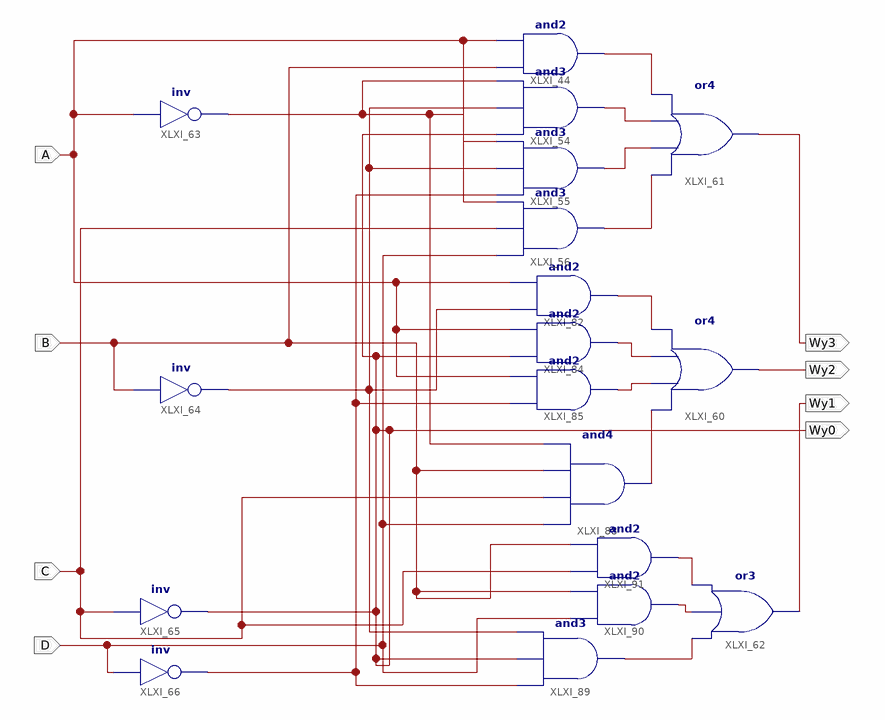
[diagram p0: schematic sheet 1]
// Xilinx ISE schematic zad3_schemat.sch (artix7) as structural Verilog: 18 symbols, 8 ports
module zad3_schemat (
  input  D,
  input  C,
  input  A,
  input  B,
  output Wy1,
  output Wy0,
  output Wy2,
  output Wy3
);

  wire XLXN_154, XLXN_159, XLXN_160, XLXN_161, XLXN_162, XLXN_163, XLXN_169, XLXN_170, XLXN_171, XLXN_172,
       XLXN_178, XLXN_179, XLXN_180, XLXN_182;

  not XLXI_63 (XLXN_154, A);
  not XLXI_64 (XLXN_182, B);
  or XLXI_60 (Wy2, XLXN_169, XLXN_170, XLXN_171, XLXN_172);
  and XLXI_82 (XLXN_172, XLXN_182, A);
  and XLXI_84 (XLXN_171, Wy0, A);
  and XLXI_85 (XLXN_170, XLXN_159, A);
  and XLXI_88 (XLXN_169, D, C, B, XLXN_154);
  not XLXI_65 (Wy0, C);
  not XLXI_66 (XLXN_159, D);
  and XLXI_44 (XLXN_163, B, A);
  and XLXI_54 (XLXN_162, Wy0, XLXN_182, XLXN_154);
  and XLXI_55 (XLXN_161, XLXN_159, XLXN_182, XLXN_154);
  and XLXI_56 (XLXN_160, D, C, A);
  or XLXI_61 (Wy3, XLXN_160, XLXN_161, XLXN_162, XLXN_163);
  or XLXI_62 (Wy1, XLXN_178, XLXN_179, XLXN_180);
  and XLXI_89 (XLXN_178, XLXN_159, Wy0, XLXN_182);
  and XLXI_90 (XLXN_179, D, B);
  and XLXI_91 (XLXN_180, C, B);
endmodule
